# Altium schematic sheet STM32_Input.SchDoc
size A; SheetNumber: 1; SheetTotal: 5
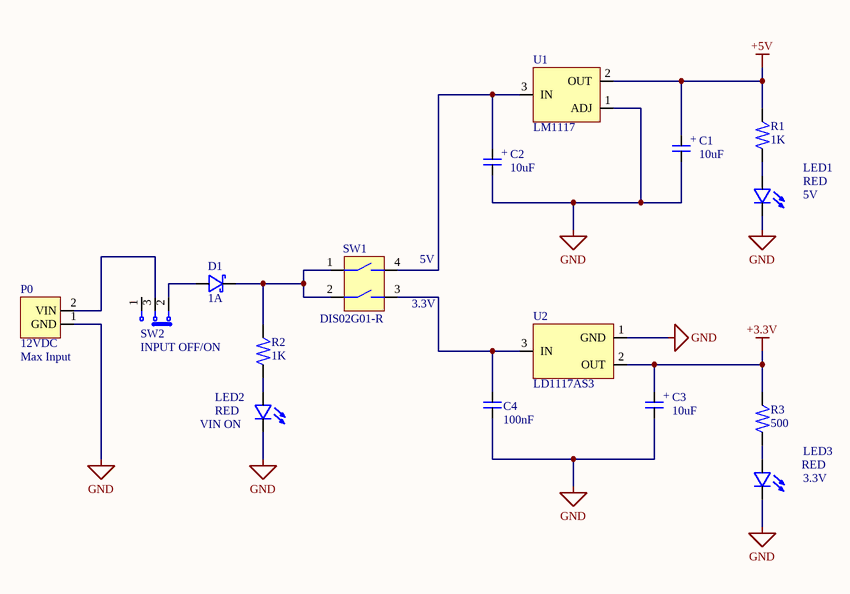
[diagram p0: STM32_Input.SchDoc]

## Parts
C1  10uF  [SMT_CAP_EL_CHANG_VT1E100MC054000CE0]
C2  10uF  [SMT_CAP_EL_CHANG_VT1E100MC054000CE0]
C3  10uF  [SMT_CAP_EL_CHANG_VT1E100MC054000CE0]
C4  100nF  [SMT_CAP_1206(3216)_SAMSUNG]
D1  1A  [SMT_DIODE_SCHTKY_SMB_ONSEMI]
LED1  RED  [DIOM2012X18N]
LED2  RED  [DIOM2012X18N]
LED3  RED  [DIOM2012X18N]
P0  12VDC  [THT_CON_WAFER_2P_STRAIGHT_A2001WV2-2P]
R1  1K  [SMT_RES_0805(2012)]
R2  1K  [SMT_RES_0805(2012)]
R3  500  [SMT_RES_0805(2012)]
SW1  DIS02G01-R  [SMT_SWITCH_DIP_DIS02G01-R]
SW2  INPUT OFF/ON  [THT_SSW_ESP1010]
U1  LM1117  [SOT230P700X180-4N]
U2  LD1117AS3  [SMT_VR_LD1117AS3]

## Nets
+3.3V: C3.1 R3.2 U2.2(OUT)
+5V: C1.1 R1.2 U1.2(OUT)
GND: C1.2 C2.2 C3.2 C4.1 LED1.2 LED2.2 LED3.2 P0.1(GND) U1.1(ADJ) U2.1(GND)
NetC2_1: C2.1 SW1.4 U1.3(IN)
NetC4_2: C4.2 SW1.3 U2.3(IN)
NetD1_1: D1.1 SW2.2
NetD1_2: D1.2 R2.2 SW1.1 SW1.2
NetLED1_1: LED1.1 R1.1
NetLED2_1: LED2.1 R2.1
NetLED3_1: LED3.1 R3.1
NetP0_2: P0.2(VIN) SW2.3

Not connected (* = marked no-connect by the designer): SW2 1

## Notes on the sheet
- 5V
- (near SW1) 5V
- (near SW1) 3.3V
- (near P0) Max Input
- (near LED2) VIN ON
- 3.3V
- (in symbol SMT_CAP_EL_CHANG_VT1E100MC054000CE0) +

## Library data of the parts
C1-C3 = SMT_CAP_EL_CHANG_VT1E100MC054000CE0: SMT Capacitor Electrolytic 35V 10uF Pitch 1.3mm VT1E100MC054000CE0
C4 = SMT_CAP_1206(3216)_SAMSUNG: Ceramic Capacitor 1206(3216) Samsung CL31B104KBCNNNC 50VDC
D1 = SMT_DIODE_SCHTKY_SMB_ONSEMI: SMT Diode Schottky ONSEMI MODEL IF=1A VR=20V FV=0.6V MBRS120T3G
LED1-LED3 = SMT_LED_0805(2012): Led Diode 0805(2012) Cathode Mark, 20mA
P0 = THT_CON_WAFER_2P_STRAIGHT_A2001WV2-2P: Connector Wafer 2-Pins Pitch-2.0mm Straight Pins A2001WV2-2P
R1-R3 = SMT_RES_0805(2012): 0805(2012) Resistor 1/4-1/8W 150V 2A
SW1 = SMT_SWITCH_DIP_DIS02G01-R: DIP SMD Switch 2-Line 4-Pole 2.54Pitch Rating 25mA/24Vdc Height 0.70mm
SW2 = THT_SSW_ESP1010: Slide Switch ESP1010 12V 0.5A
U1 = LM1117_SOT-223: LM1117 SOT-223 5V HTC Voltage Regulator
U2 = SMT_VR_LD1117AS3: Voltage Regulator ST LD1117AS33TR 1A 3.3V 10Vmax